# Altium schematic sheet INPUT.SchDoc
size A
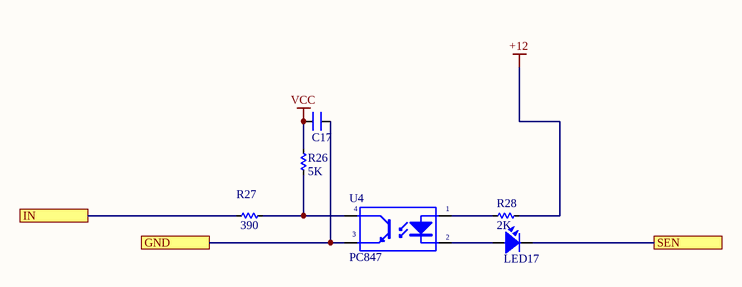
[diagram p0: INPUT.SchDoc]

## Parts
C17  CN  [CN-SMD-0603_big]  (value not drawn)
LED17  LED  [LED-0805-Green]  (value not drawn)
R26  5K  [RES-SMD-0603_BIG]
R27  390  [RES-SMD-0603_BIG]
R28  2K  [RES-SMD-0603_BIG]
U4  PC847  [DIP4]

## Ports
GND, IN, SEN

## Nets
+12: R28.1
VCC: C17.1 R26.1
GND: C17.2 U4.3(E) ; port GND
IN: R27.1 ; port IN
SEN: LED17.2 ; port SEN
NetLED17_1: LED17.1 U4.2(K)
NetR26_2: R26.2 R27.2 U4.4(C)
NetR28_2: R28.2 U4.1(A)

## Library data of the parts
C17 = CN: Value: 33pF
LED17 = LED SMD: Value: LED 3 - 5 ly 2 Colour
R26-R28 = R
U4 = PC817: Single Opto; Value: PC817